# EAGLE schematic CrowBot -V1.4-20220909 (EAGLE 9.5.1)
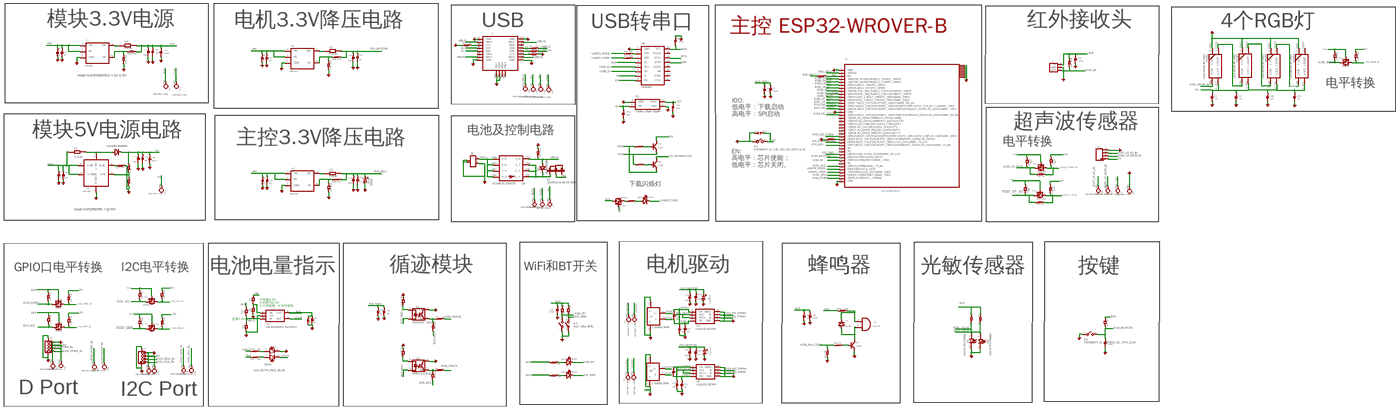
[diagram p0: schematic, sheet 1, overview]
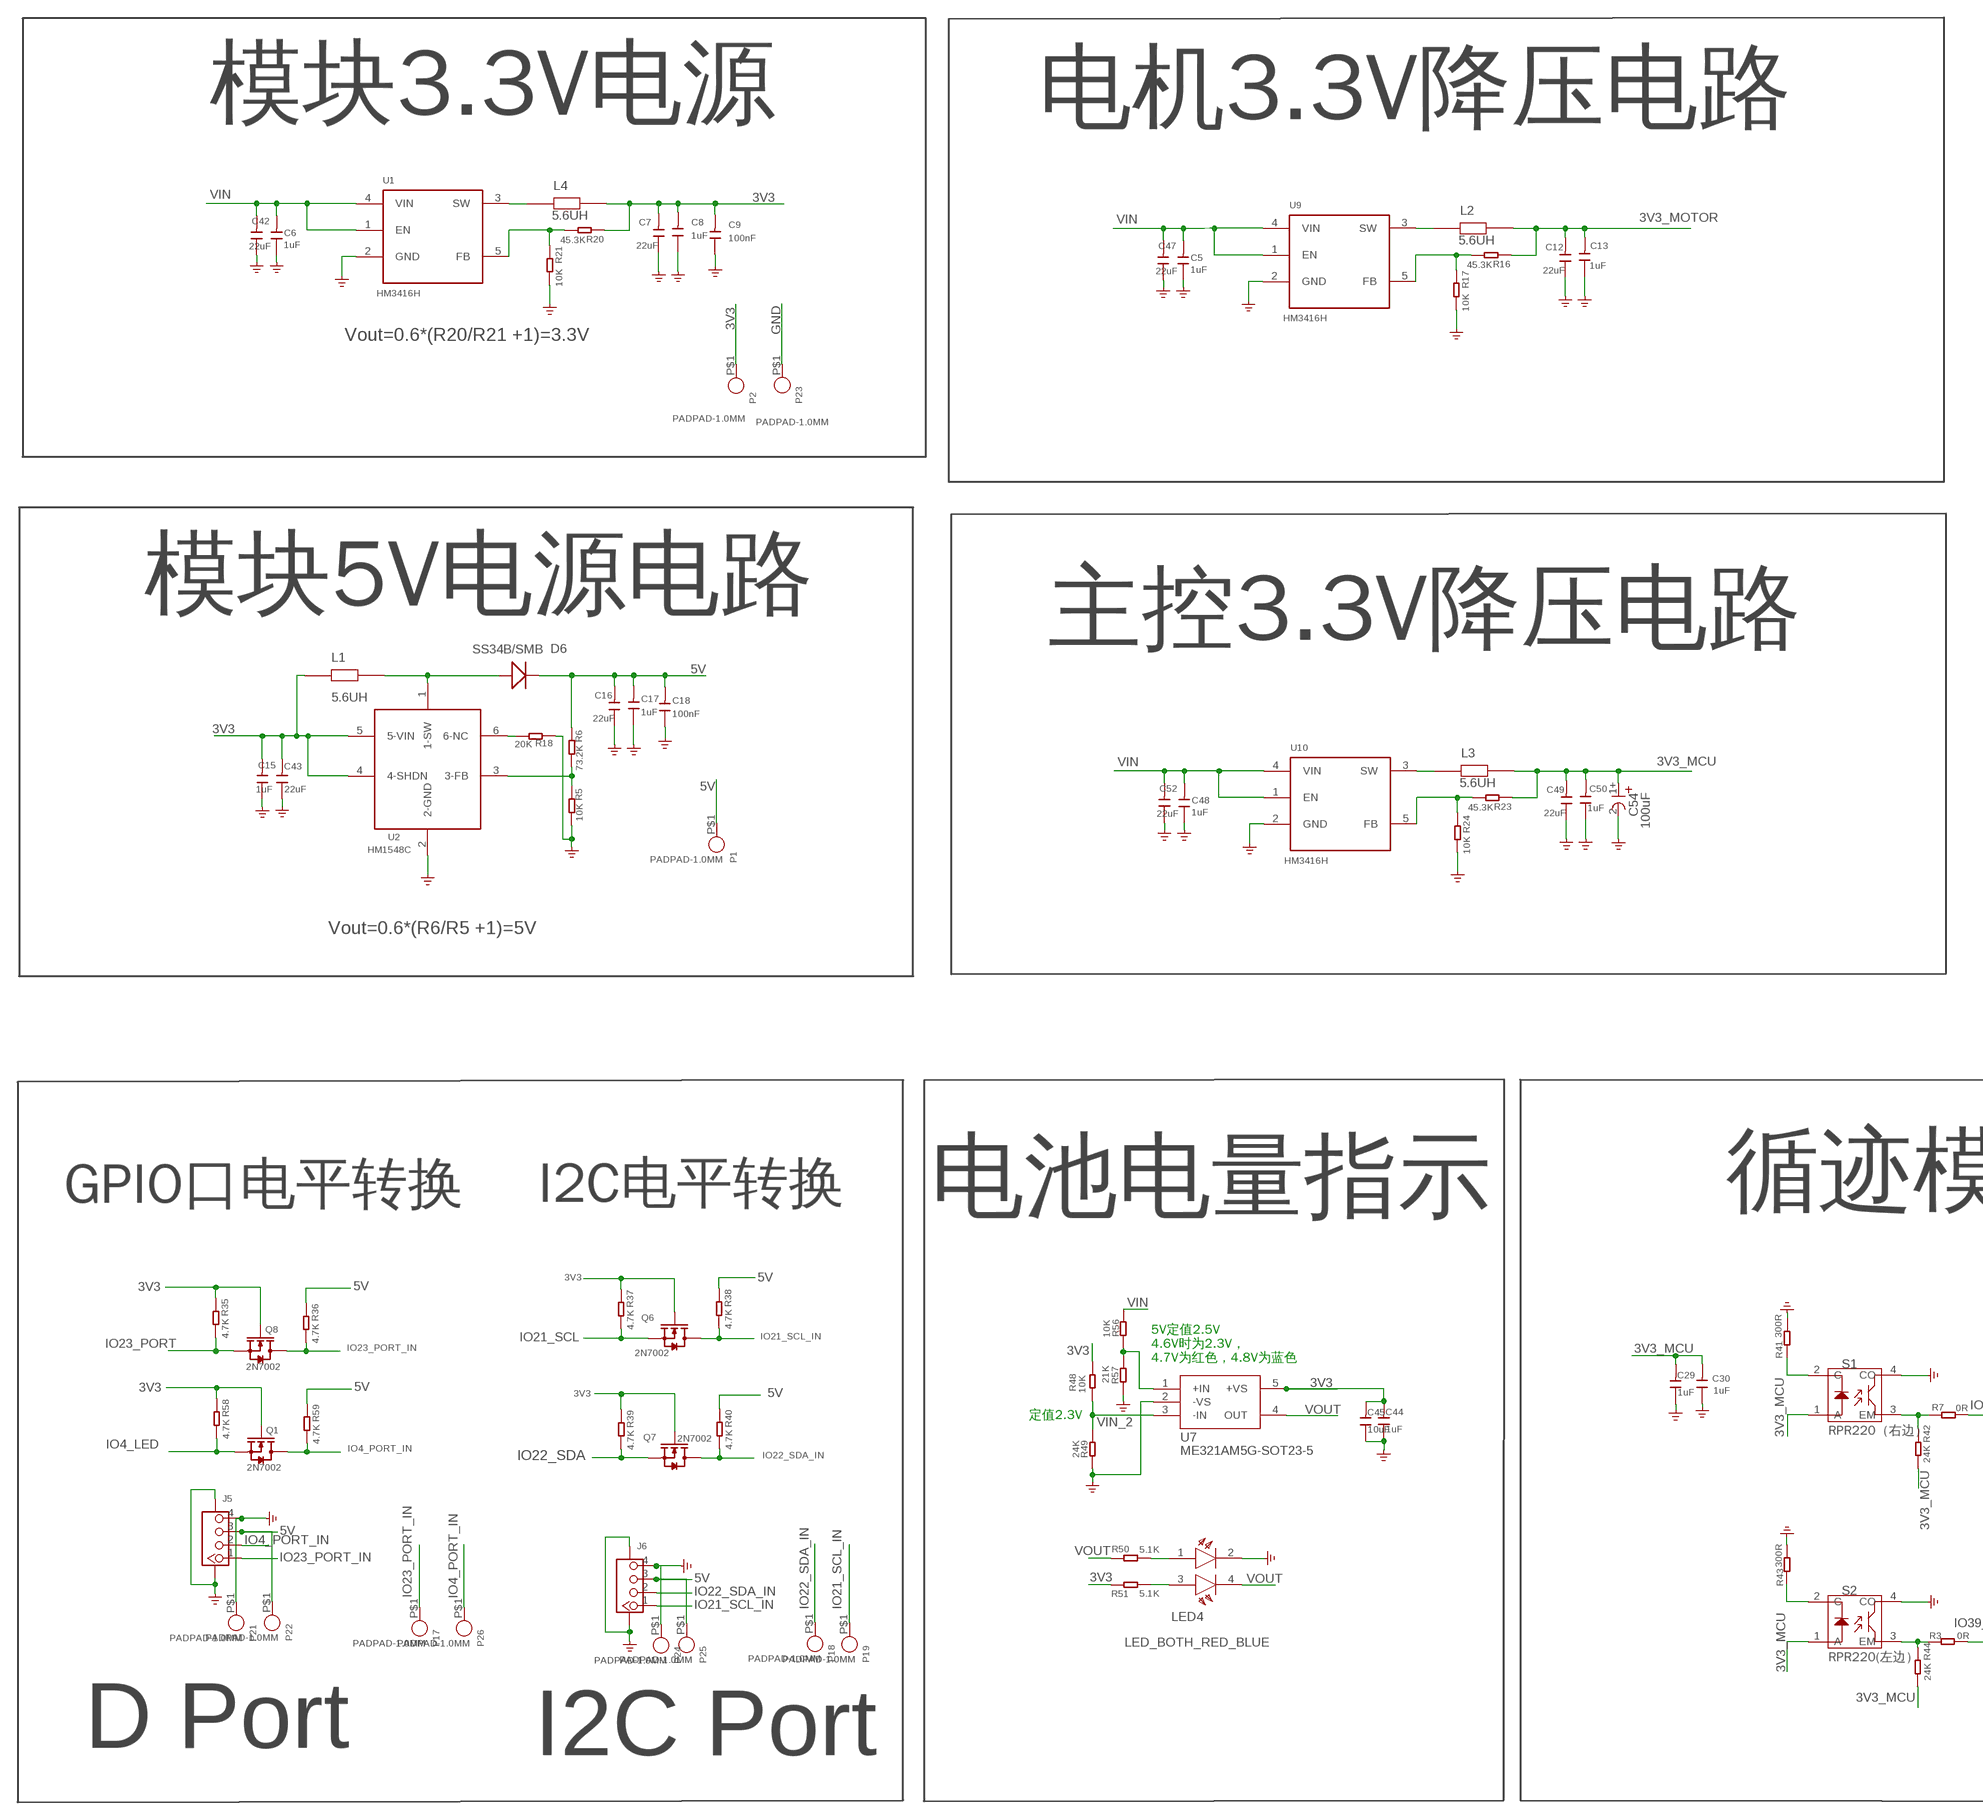
[diagram p1: schematic, sheet 1, part 1 of 4]
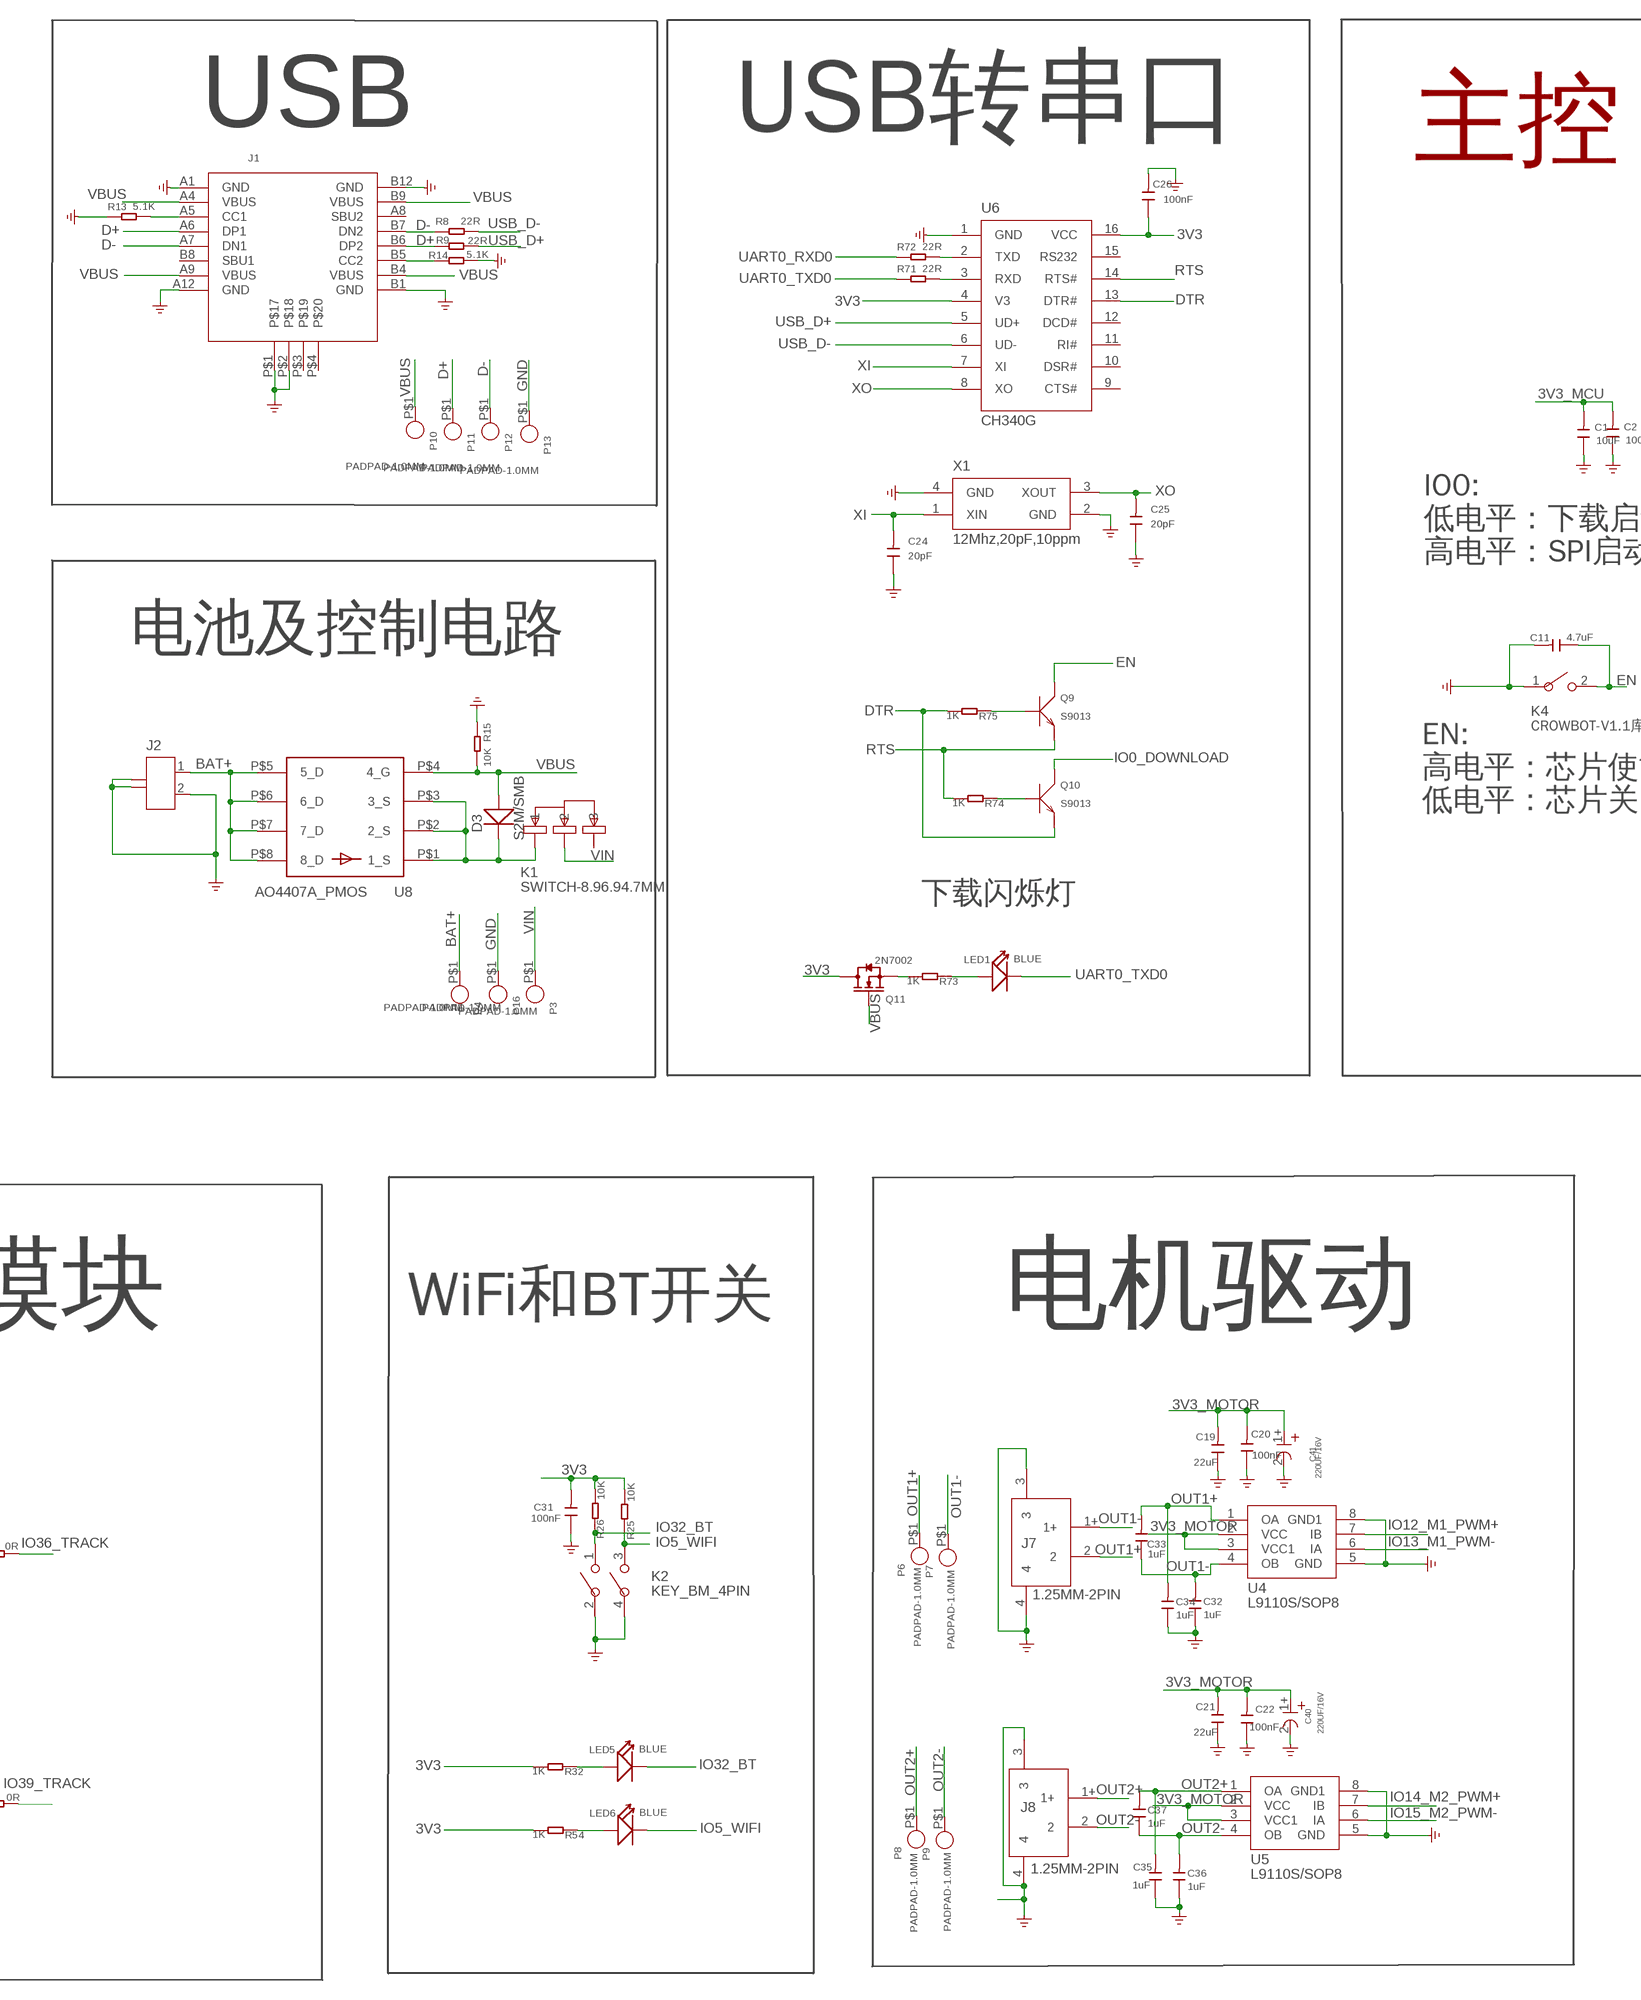
[diagram p2: schematic, sheet 1, part 2 of 4]
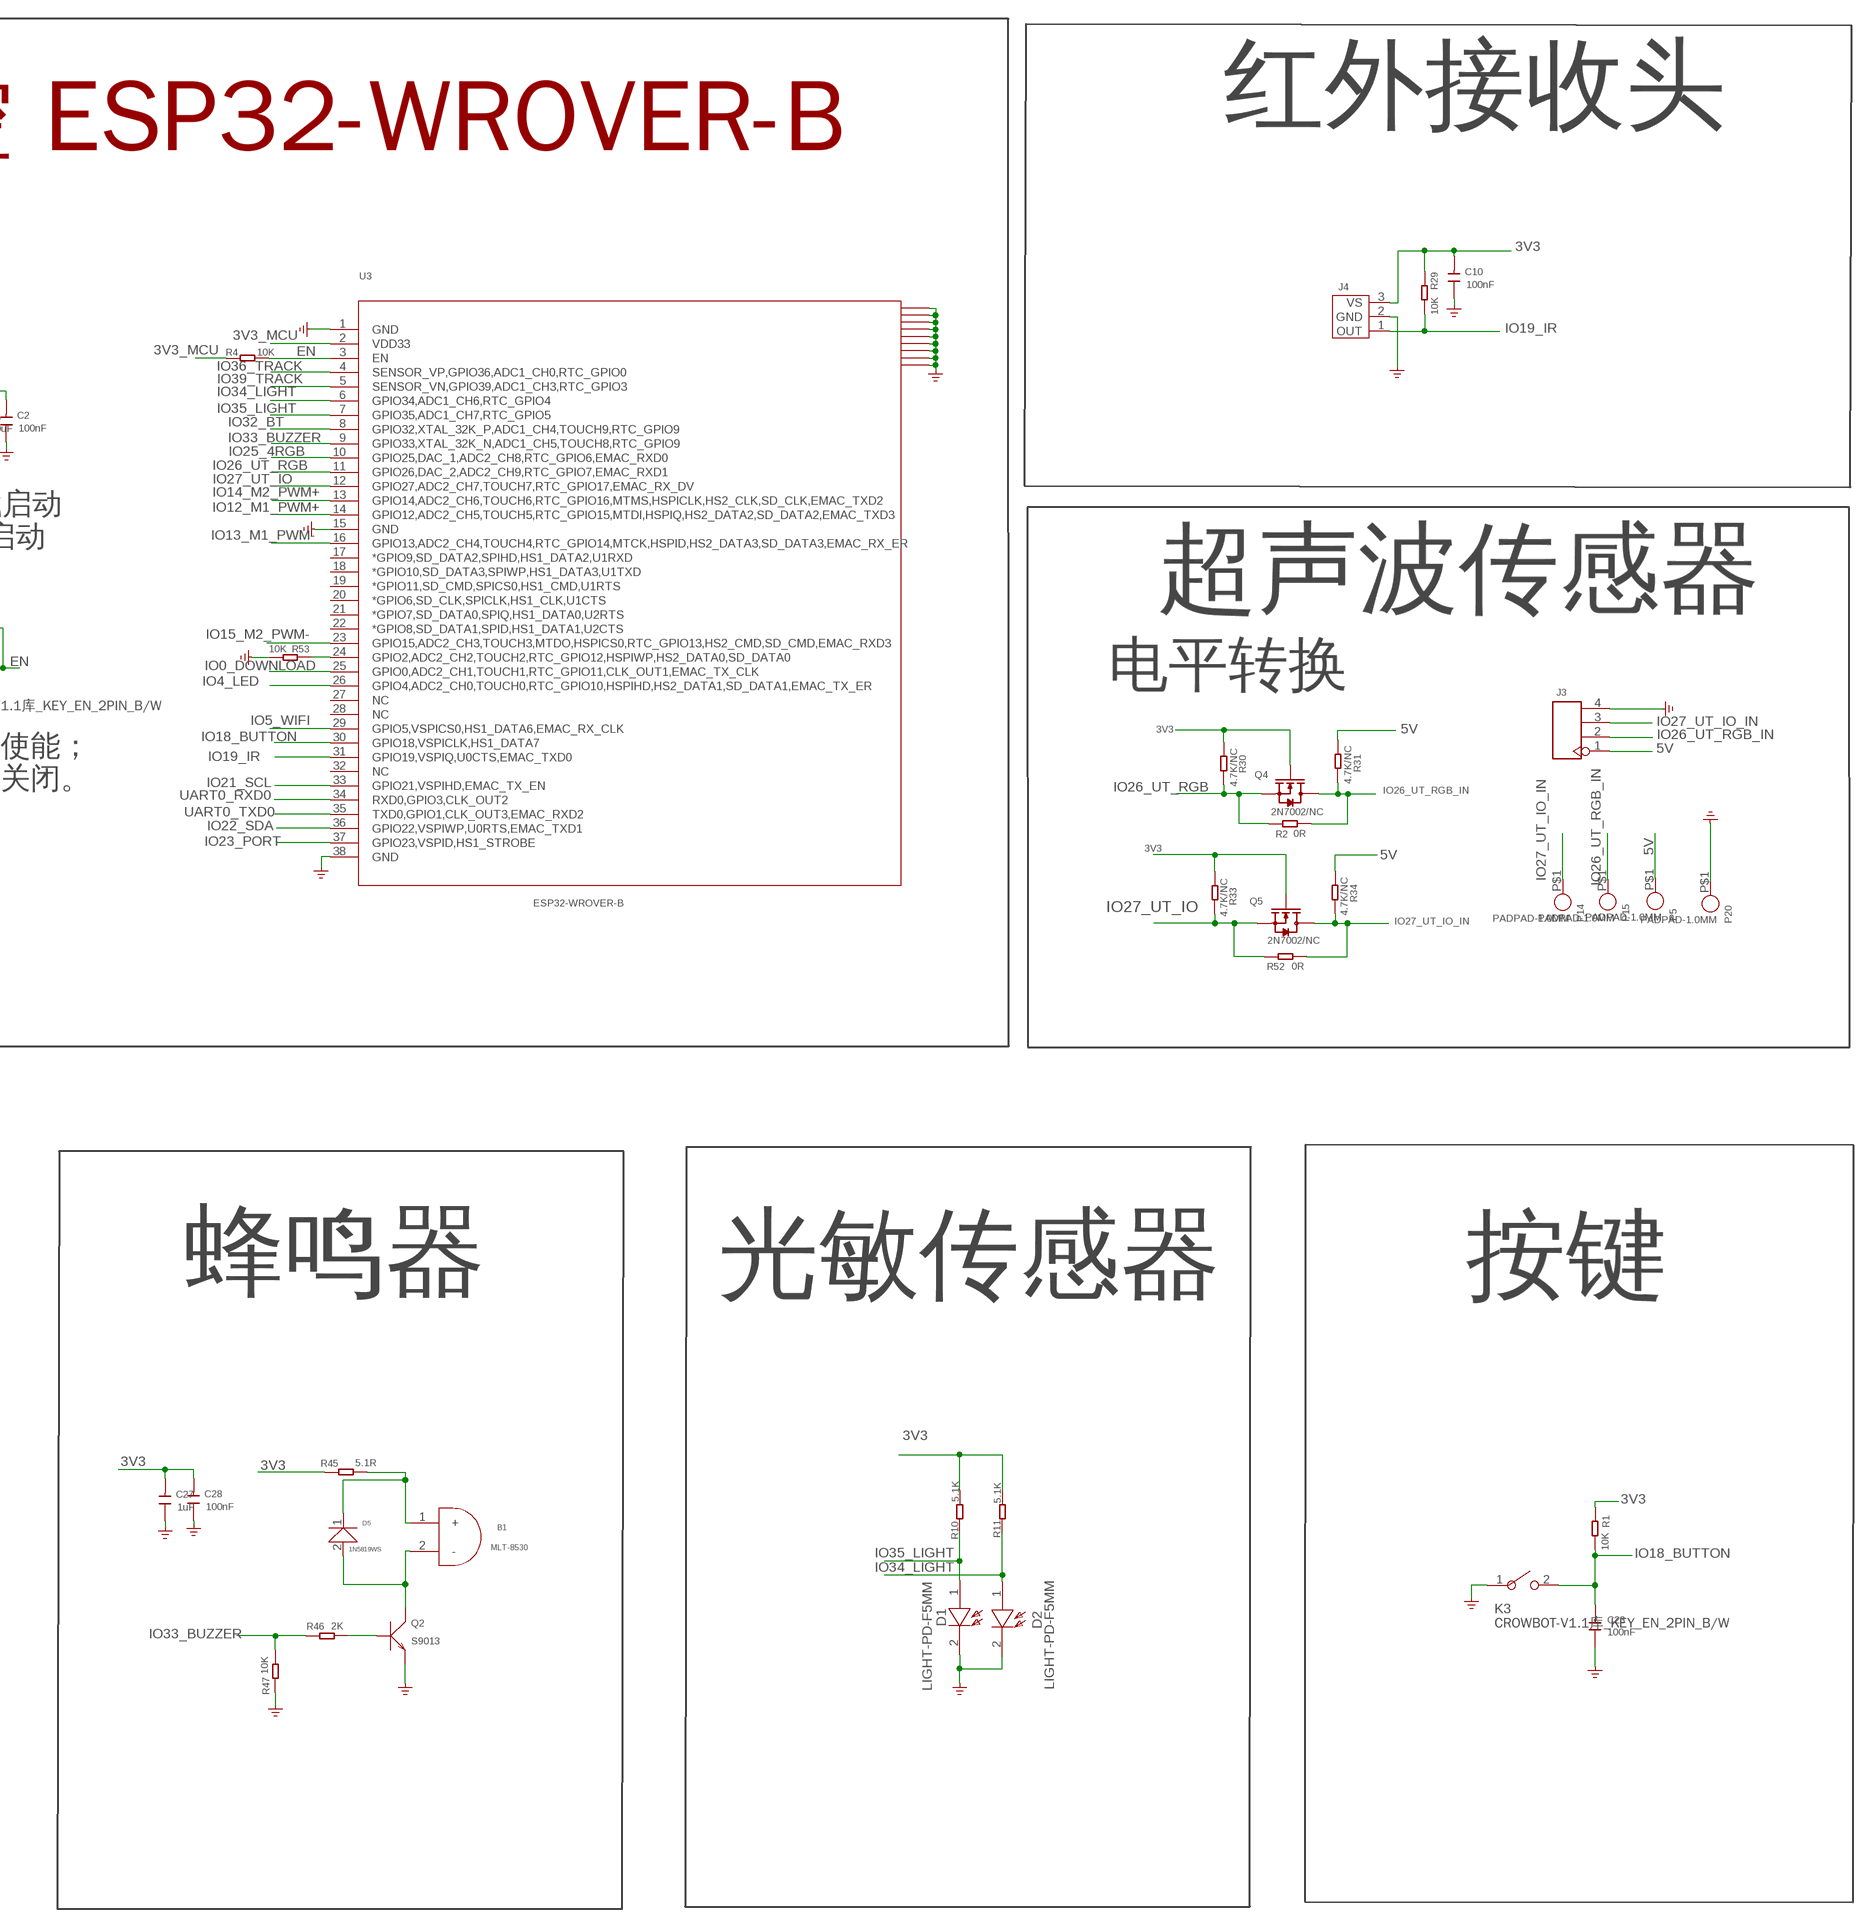
[diagram p3: schematic, sheet 1, part 3 of 4]
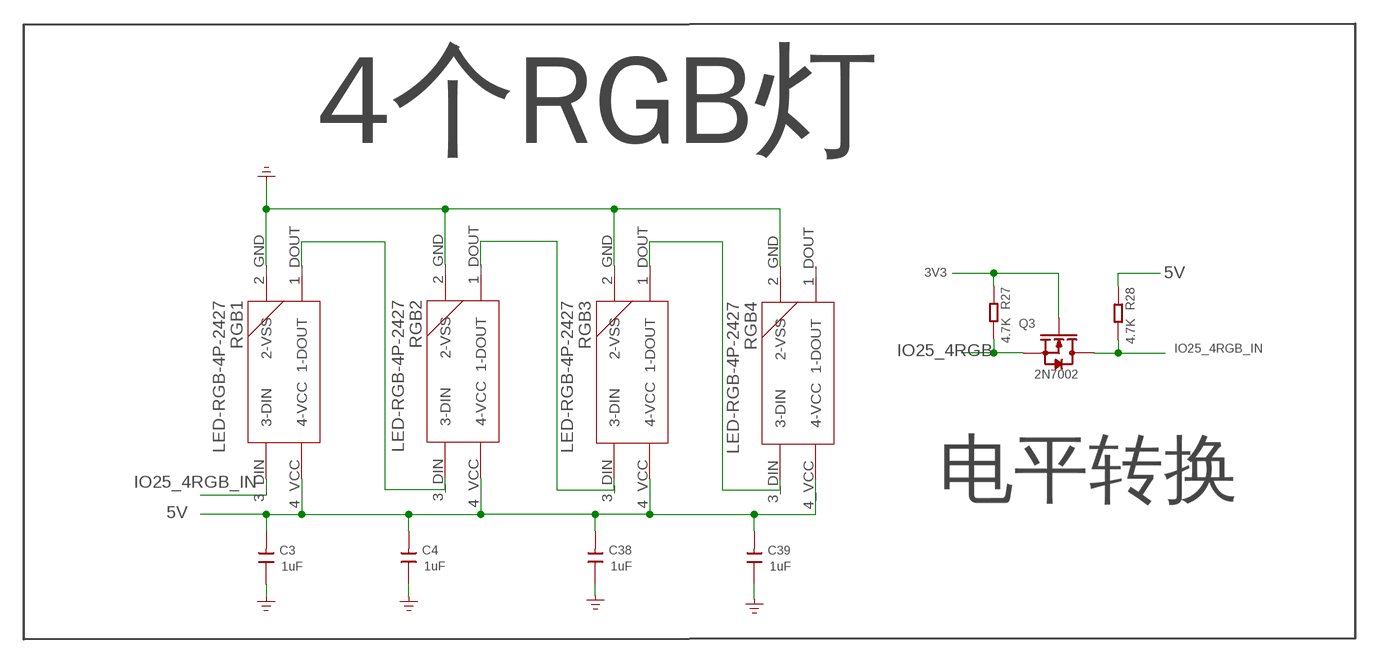
[diagram p4: schematic, sheet 1, part 4 of 4]

## Parts
B1  MLT-8530  [MLT-8530]
C1  10uF  DISCRETE_C-0603  [DISCRETE_C0603]
C2  100nF  DISCRETE_C-0603  [DISCRETE_C0603]
C3  1uF  DISCRETE_C-0603  [DISCRETE_C0603]
C4  1uF  DISCRETE_C-0603  [DISCRETE_C0603]
C5  1uF  C0603  [0603]
C6  1uF  C0603  [0603]
C7  22uF  C0805  [0805]
C8  1uF  C0603  [0603]
C9  100nF  C0603  [0603]
C10  100nF  DISCRETE_C-0603  [DISCRETE_C0603]
C11  4.7uF  C0603  [0603]
C12  22uF  C0805  [0805]
C13  1uF  C0603  [0603]
C15  1uF  C0603  [0603]
C16  22uF  C0805  [0805]
C17  1uF  C0603  [0603]
C18  100nF  C0603  [0603]
C19  22uF  C0805  [0805]
C20  100nF  DISCRETE_C-0603  [DISCRETE_C0603]
C21  22uF  C0805  [0805]
C22  100nF  DISCRETE_C-0603  [DISCRETE_C0603]
C23  100nF  DISCRETE_C-0603  [DISCRETE_C0603]
C24  20pF  C0603  [0603]
C25  20pF  C0603  [0603]
C26  100nF  C0603  [0603]
C27  1uF  DISCRETE_C-0603  [DISCRETE_C0603]
C28  100nF  DISCRETE_C-0603  [DISCRETE_C0603]
C29  1uF  DISCRETE_C-0603  [DISCRETE_C0603]
C30  1uF  DISCRETE_C-0603  [DISCRETE_C0603]
C31  100nF  DISCRETE_C-0603  [DISCRETE_C0603]
C32  1uF  C0603  [0603]
C33  1uF  C0603  [0603]
C34  1uF  C0603  [0603]
C35  1uF  C0603  [0603]
C36  1uF  C0603  [0603]
C37  1uF  C0603  [0603]
C38  1uF  DISCRETE_C-0603  [DISCRETE_C0603]
C39  1uF  DISCRETE_C-0603  [DISCRETE_C0603]
C40  220UF/16V  CAP_220UF_SMD_6.35.4MM  [CAP_220UF_SMD_6.3*5.4MM]
C41  220UF/16V  CAP_220UF_SMD_6.35.4MM  [CAP_220UF_SMD_6.3*5.4MM]
C42  22uF  C0805  [0805]
C43  22uF  C0805  [0805]
C44  1uF  DISCRETE_C-0603  [DISCRETE_C0603]
C45  10uF  DISCRETE_C-0603  [DISCRETE_C0603]
C47  22uF  C0805  [0805]
C48  1uF  C0603  [0603]
C49  22uF  C0805  [0805]
C50  1uF  C0603  [0603]
C52  22uF  C0805  [0805]
C54  100uF  CAP-100UF-SMD-6.34.5MM  [CAP-100UF-SMD-6.3*4.5MM]
D1  LIGHT-PD-F5MM  [LIGHT-PD-F5MM]
D2  LIGHT-PD-F5MM  [LIGHT-PD-F5MM]
D3  S2M/SMB  214ABDO-214AB  [214AB]
D5  1N5819WS  [SOD-323]
D6  SS34B/SMB  214ABDO-214AB  [214AB]
J1  TYPEC-3.0-16P-SMD  [TYPEC-3.0-16P-SMD]
J2  PH2.0_2P  [PH2.0_2P]
J3  HEADER-4P-80/40MIL  [4P-2.54-80/40MIL]
J4  TSOP382  [3P-2.54-4.8X5X6.95H]
J5  CONNECTOR_TWIG-4P-2.0-SMD-FEMALE-REINFORCE90D  [CONNECTOR_4P-SMD-2.0-90D]
J6  CONNECTOR_TWIG-4P-2.0-SMD-FEMALE-REINFORCE90D  [CONNECTOR_4P-SMD-2.0-90D]
J7  1.25MM-2PIN  CROWBOT-V1.0库_1.25MM-2PIN  [CROWBOT-V1.0库_1.25MM-2PIN]
J8  1.25MM-2PIN  CROWBOT-V1.0库_1.25MM-2PIN  [CROWBOT-V1.0库_1.25MM-2PIN]
K1  SWITCH-8.96.94.7MM  [SWITCH-8.9*6.9*4.7MM]
K2  KEY_BM_4PIN  [KEY_BM_4PIN]
K3  CROWBOT-V1.1库_KEY_EN_2PIN_B/W  [CROWBOT-V1.1库_KEY_EN_2PIN_B/W]
K4  CROWBOT-V1.1库_KEY_EN_2PIN_B/W  [CROWBOT-V1.1库_KEY_EN_2PIN_B/W]
L1  5.6UH  CROWPI2-MB-V1.4-20211012_CMP201209UD1R0MT  [CD54]
L2  5.6UH  CROWPI2-MB-V1.4-20211012_CMP201209UD1R0MT  [CD54]
L3  5.6UH  CROWPI2-MB-V1.4-20211012_CMP201209UD1R0MT  [CD54]
L4  5.6UH  CROWPI2-MB-V1.4-20211012_CMP201209UD1R0MT  [CD54]
LED1  BLUE  DISCRETE_LED0603  [DISCRETE_LED-0603]
LED4  LED_BOTH_RED_BLUE  [LED_BOTH_RED_BLUE_SMD_1.6*1.6*0.6MM]
LED5  BLUE  DISCRETE_LED0603  [DISCRETE_LED-0603]
LED6  BLUE  DISCRETE_LED0603  [DISCRETE_LED-0603]
P1  PADPAD-1.0MM  [PAD-1.0MM]
P2  PADPAD-1.0MM  [PAD-1.0MM]
P3  PADPAD-1.0MM  [PAD-1.0MM]
P4  PADPAD-1.0MM  [PAD-1.0MM]
P5  PADPAD-1.0MM  [PAD-1.0MM]
P6  PADPAD-1.0MM  [PAD-1.0MM]
P7  PADPAD-1.0MM  [PAD-1.0MM]
P8  PADPAD-1.0MM  [PAD-1.0MM]
P9  PADPAD-1.0MM  [PAD-1.0MM]
P10  PADPAD-1.0MM  [PAD-1.0MM]
P11  PADPAD-1.0MM  [PAD-1.0MM]
P12  PADPAD-1.0MM  [PAD-1.0MM]
P13  PADPAD-1.0MM  [PAD-1.0MM]
P14  PADPAD-1.0MM  [PAD-1.0MM]
P15  PADPAD-1.0MM  [PAD-1.0MM]
P16  PADPAD-1.0MM  [PAD-1.0MM]
P17  PADPAD-1.0MM  [PAD-1.0MM]
P18  PADPAD-1.0MM  [PAD-1.0MM]
P19  PADPAD-1.0MM  [PAD-1.0MM]
P20  PADPAD-1.0MM  [PAD-1.0MM]
P21  PADPAD-1.0MM  [PAD-1.0MM]
P22  PADPAD-1.0MM  [PAD-1.0MM]
P23  PADPAD-1.0MM  [PAD-1.0MM]
P24  PADPAD-1.0MM  [PAD-1.0MM]
P25  PADPAD-1.0MM  [PAD-1.0MM]
P26  PADPAD-1.0MM  [PAD-1.0MM]
Q1  2N7002  MOSFET-N'SOT23'  [SOT23]
Q2  S9013  TRANSISTOR-NPN-SOT23  [SOT23@1]
Q3  2N7002  MOSFET-N'SOT23'  [SOT23]
Q4  2N7002/NC  MOSFET-N'SOT23'  [SOT23]
Q5  2N7002/NC  MOSFET-N'SOT23'  [SOT23]
Q6  2N7002  MOSFET-N'SOT23'  [SOT23]
Q7  2N7002  MOSFET-N'SOT23'  [SOT23]
Q8  2N7002  MOSFET-N'SOT23'  [SOT23]
Q9  S9013  TRANSISTOR-NPN-SOT23  [SOT23@1]
Q10  S9013  TRANSISTOR-NPN-SOT23  [SOT23@1]
Q11  2N7002  MOSFET-N'SOT23'  [SOT23]
R1  10K  DISCRETE_R-0603  [DISCRETE_R0603]
R2  0R  DISCRETE_R-0603  [DISCRETE_R0603]
R3  0R  005-R0603_S  [0603_S]
R4  10K  R0603  [R0603]
R5  10K  DISCRETE_R-0603  [DISCRETE_R0603]
R6  73.2K  DISCRETE_R-0603  [DISCRETE_R0603]
R7  0R  005-R0603_S  [0603_S]
R8  22R  DISCRETE_R-0603  [DISCRETE_R0603]
R9  22R  DISCRETE_R-0603  [DISCRETE_R0603]
R10  5.1K  DISCRETE_R-0603  [DISCRETE_R0603]
R11  5.1K  DISCRETE_R-0603  [DISCRETE_R0603]
R13  5.1K  DISCRETE_R-0603  [DISCRETE_R0603]
R14  5.1K  DISCRETE_R-0603  [DISCRETE_R0603]
R15  10K  DISCRETE_R-0603  [DISCRETE_R0603]
R16  45.3K  DISCRETE_R-0603  [DISCRETE_R0603]
R17  10K  DISCRETE_R-0603  [DISCRETE_R0603]
R18  20K  DISCRETE_R-0603  [DISCRETE_R0603]
R20  45.3K  DISCRETE_R-0603  [DISCRETE_R0603]
R21  10K  DISCRETE_R-0603  [DISCRETE_R0603]
R23  45.3K  DISCRETE_R-0603  [DISCRETE_R0603]
R24  10K  DISCRETE_R-0603  [DISCRETE_R0603]
R25  10K  005-R0603_S  [0603_S]
R26  10K  005-R0603_S  [0603_S]
R27  4.7K  DISCRETE_R-0603  [DISCRETE_R0603]
R28  4.7K  DISCRETE_R-0603  [DISCRETE_R0603]
R29  10K  DISCRETE_R-0603  [DISCRETE_R0603]
R30  4.7K/NC  DISCRETE_R-0603  [DISCRETE_R0603]
R31  4.7K/NC  DISCRETE_R-0603  [DISCRETE_R0603]
R32  1K  DISCRETE_R-0603  [DISCRETE_R0603]
R33  4.7K/NC  DISCRETE_R-0603  [DISCRETE_R0603]
R34  4.7K/NC  DISCRETE_R-0603  [DISCRETE_R0603]
R35  4.7K  DISCRETE_R-0603  [DISCRETE_R0603]
R36  4.7K  DISCRETE_R-0603  [DISCRETE_R0603]
R37  4.7K  DISCRETE_R-0603  [DISCRETE_R0603]
R38  4.7K  DISCRETE_R-0603  [DISCRETE_R0603]
R39  4.7K  DISCRETE_R-0603  [DISCRETE_R0603]
R40  4.7K  DISCRETE_R-0603  [DISCRETE_R0603]
R41  300R  005-R0603_S  [0603_S]
R42  24K  005-R0603_S  [0603_S]
R43  300R  005-R0603_S  [0603_S]
R44  24K  005-R0603_S  [0603_S]
R45  5.1R  R0603  [R0603]
R46  2K  DISCRETE_R-0603  [DISCRETE_R0603]
R47  10K  DISCRETE_R-0603  [DISCRETE_R0603]
R48  10K  R0603  [R0603]
R49  24K  R0603  [R0603]
R50  5.1K  DISCRETE_R-0603  [DISCRETE_R0603]
R51  5.1K  DISCRETE_R-0603  [DISCRETE_R0603]
R52  0R  DISCRETE_R-0603  [DISCRETE_R0603]
R53  10K  DISCRETE_R-0603  [DISCRETE_R0603]
R54  1K  DISCRETE_R-0603  [DISCRETE_R0603]
R56  10K  R0603  [R0603]
R57  21K  R0603  [R0603]
R58  4.7K  DISCRETE_R-0603  [DISCRETE_R0603]
R59  4.7K  DISCRETE_R-0603  [DISCRETE_R0603]
R71  22R  DISCRETE_R-0603  [DISCRETE_R0603]
R72  22R  DISCRETE_R-0603  [DISCRETE_R0603]
R73  1K  DISCRETE_R-0603  [DISCRETE_R0603]
R74  1K  DISCRETE_R-0603  [DISCRETE_R0603]
R75  1K  DISCRETE_R-0603  [DISCRETE_R0603]
RGB1  LED-RGB-4P-2427  [LED-RGB-4P-SMD-2427]
RGB2  LED-RGB-4P-2427  [LED-RGB-4P-SMD-2427]
RGB3  LED-RGB-4P-2427  [LED-RGB-4P-SMD-2427]
RGB4  LED-RGB-4P-2427  [LED-RGB-4P-SMD-2427]
S1  RPR220（右边）  REFLECTIVE-PHOTOSENSOR-RPR-220  [4P-6.4X4.9X6.5H]
S2  RPR220(左边）  REFLECTIVE-PHOTOSENSOR-RPR-220  [4P-6.4X4.9X6.5H]
U1  HM3416H  A_XBJ_HM3420B  [A_XBJ_SOT23-5]
U2  HM1548C  HM1548/SOT23-6  [A_XBJ_SOT23-6]
U3  ESP32-WROVER-B  [ESP32-WROVER-B]
U4  L9110S/SOP8  [L9110S/SOP8]
U5  L9110S/SOP8  [L9110S/SOP8]
U6  CH340G  [SOP-16]
U7  ME321AM5G-SOT23-5  [ME321AM5G-SOT23-5]
U8  AO4407A_PMOS  T_PMOS_AO4407A_SOP8  [SOP8]
U9  HM3416H  A_XBJ_HM3420B  [A_XBJ_SOT23-5]
U10  HM3416H  A_XBJ_HM3420B  [A_XBJ_SOT23-5]
X1  12Mhz,20pF,10ppm  XTAL  [SMD3225]

## Nets
3V3: C7.2 C8.2 C9.2 C10.2 C15.2 C26.1 C27.2 C28.2 C31.2 C43.2 C44.2 C45.2 J4.3(VS) L1.1 L4.2 P2.P$1 Q1.1(G) Q3.1(G) Q4.1(G) Q5.1(G) Q6.1(G) Q7.1(G) Q8.1(G) Q11.3(D) R1.1 R10.2 R11.2 R20.1 R25.2 R26.2 R27.1 R29.1 R30.1 R32.2 R33.1 R35.1 R37.1 R39.1 R45.1 R48.1 R51.2 R54.2 R58.1 U2.4(4-SHDN) U2.5(5-VIN) U6.4(V3) U6.16(VCC) U7.5(+VS)
3V3_MCU: C1.2 C2.2 C29.2 C30.2 C49.2 C50.2 C54.1+ L3.2 R4.1 R23.1 R42.1 R44.1 S1.1(A) S2.1(A) U3.2(VDD33)
3V3_MOTOR: C12.2 C13.2 C19.2 C20.2 C21.2 C22.2 C40.1+ C41.1+ L2.2 R16.1 U4.2(VCC) U4.3(VCC1) U5.2(VCC) U5.3(VCC1)
5V: C3.2 C4.2 C16.2 C17.2 C18.2 C38.2 C39.2 D6.2(-) J3.1 J5.3 J6.3 P1.P$1 P5.P$1 P22.P$1 P25.P$1 R6.1 R28.1 R31.1 R34.1 R36.1 R38.1 R40.1 R59.1 RGB1.4_VCC(4-VCC) RGB2.4_VCC(4-VCC) RGB3.4_VCC(4-VCC) RGB4.4_VCC(4-VCC)
BAT+: J2.1 P4.P$1 U8.P$5(5_D) U8.P$6(6_D) U8.P$7(7_D) U8.P$8(8_D)
D+: J1.A6(DP1) J1.B6(DP2) P11.P$1 R9.1
D-: J1.A7(DN1) J1.B7(DN2) P12.P$1 R8.1
DTR: Q10.2(E) R75.2 U6.13(DTR#)
EN: C11.1 K4.2 Q9.3(C) R4.2 U3.3(EN)
GND: C1.1 C2.1 C3.1 C4.1 C5.1 C6.1 C7.1 C8.1 C9.1 C10.1 C11.2 C12.1 C13.1 C15.1 C16.1 C17.1 C18.1 C19.1 C20.1 C21.1 C22.1 C23.1 C24.1 C25.1 C26.2 C27.1 C28.1 C29.1 C30.1 C31.1 C32.1 C34.1 C35.1 C36.1 C38.1 C39.1 C40.2- C41.2- C42.1 C43.1 C44.1 C45.1 C47.1 C48.1 C49.1 C50.1 C52.1 C54.2- D1.2 D2.2 J1.A1(GND) J1.A12(GND) J1.B1(GND) J1.B12(GND) J1.P$1 J1.P$2 J2.2 J2.3 J2.4 J3.4 J4.2(GND) J5.4 J5.SS1 J5.SS2 J6.4 J6.SS1 J6.SS2 J7.3 J7.4 J8.3 J8.4 K2.2 K2.4 K3.1 K4.1 LED4.2 P13.P$1 P16.P$1 P20.P$1 P21.P$1 P23.P$1 P24.P$1 Q2.2(E) R5.2 R13.1 R14.2 R15.1 R17.2 R18.1 R21.2 R24.2 R41.1 R43.1 R47.1 R49.2 R53.2 R57.2 RGB1.2_GND(2-VSS) RGB2.2_GND(2-VSS) RGB3.2_GND(2-VSS) RGB4.2_GND(2-VSS) S1.4(CO) S2.4(CO) U1.2(GND) U2.2(2-GND) U3.1(GND) U3.15(GND) U3.38(GND) U3.39(GND) U3.40(GND) U3.41(GND) U3.42(GND) U3.43(GND) U3.44(GND) U3.45(GND) U3.46(GND) U3.47(GND) U4.5(GND) U4.8(GND1) U5.5(GND) U5.8(GND1) U6.1(GND) U7.2(-VS) U9.2(GND) U10.2(GND) X1.2(GND) X1.4(GND)
IO0_DOWNLOAD: Q10.3(C) U3.25(GPIO0,ADC2_CH1,TOUCH1,RTC_GPIO11,CLK_OUT1,EMAC_TX_CLK)
IO4_LED: Q1.2(S) R58.2 U3.26(GPIO4,ADC2_CH0,TOUCH0,RTC_GPIO10,HSPIHD,HS2_DATA1,SD_DATA1,EMAC_TX_ER)
IO4_PORT_IN: J5.2 P26.P$1 Q1.3(D) R59.2
IO5_WIFI: K2.3 LED6.- R25.1 U3.29(GPIO5,VSPICS0,HS1_DATA6,EMAC_RX_CLK)
IO12_M1_PWM+: U3.14(GPIO12,ADC2_CH5,TOUCH5,RTC_GPIO15,MTDI,HSPIQ,HS2_DATA2,SD_DATA2,EMAC_TXD3) U4.7(IB)
IO13_M1_PWM-: U3.16(GPIO13,ADC2_CH4,TOUCH4,RTC_GPIO14,MTCK,HSPID,HS2_DATA3,SD_DATA3,EMAC_RX_ER) U4.6(IA)
IO14_M2_PWM+: U3.13(GPIO14,ADC2_CH6,TOUCH6,RTC_GPIO16,MTMS,HSPICLK,HS2_CLK,SD_CLK,EMAC_TXD2) U5.7(IB)
IO15_M2_PWM-: U3.23(GPIO15,ADC2_CH3,TOUCH3,MTDO,HSPICS0,RTC_GPIO13,HS2_CMD,SD_CMD,EMAC_RXD3) U5.6(IA)
IO18_BUTTON: C23.2 K3.2 R1.2 U3.30(GPIO18,VSPICLK,HS1_DATA7)
IO19_IR: J4.1(OUT) R29.2 U3.31(GPIO19,VSPIQ,U0CTS,EMAC_TXD0)
IO21_SCL: Q6.2(S) R37.2 U3.33(GPIO21,VSPIHD,EMAC_TX_EN)
IO21_SCL_IN: J6.1 P19.P$1 Q6.3(D) R38.2
IO22_SDA: Q7.2(S) R39.2 U3.36(GPIO22,VSPIWP,U0RTS,EMAC_TXD1)
IO22_SDA_IN: J6.2 P18.P$1 Q7.3(D) R40.2
IO23_PORT: Q8.2(S) R35.2 U3.37(GPIO23,VSPID,HS1_STROBE)
IO23_PORT_IN: J5.1 P17.P$1 Q8.3(D) R36.2
IO25_4RGB: Q3.2(S) R27.2 U3.10(GPIO25,DAC_1,ADC2_CH8,RTC_GPIO6,EMAC_RXD0)
IO25_4RGB_IN: Q3.3(D) R28.2 RGB1.3_DIN(3-DIN)
IO26_UT_RGB: Q4.2(S) R2.1 R30.2 U3.11(GPIO26,DAC_2,ADC2_CH9,RTC_GPIO7,EMAC_RXD1)
IO26_UT_RGB_IN: J3.2 P15.P$1 Q4.3(D) R2.2 R31.2
IO27_UT_IO: Q5.2(S) R33.2 R52.1 U3.12(GPIO27,ADC2_CH7,TOUCH7,RTC_GPIO17,EMAC_RX_DV)
IO27_UT_IO_IN: J3.3 P14.P$1 Q5.3(D) R34.2 R52.2
IO32_BT: K2.1 LED5.- R26.1 U3.8(GPIO32,XTAL_32K_P,ADC1_CH4,TOUCH9,RTC_GPIO9)
IO33_BUZZER: R46.1 R47.2 U3.9(GPIO33,XTAL_32K_N,ADC1_CH5,TOUCH8,RTC_GPIO9)
IO34_LIGHT: D2.1 R11.1 U3.6(GPIO34,ADC1_CH6,RTC_GPIO4)
IO35_LIGHT: D1.1 R10.1 U3.7(GPIO35,ADC1_CH7,RTC_GPIO5)
IO36_TRACK: R7.2 U3.4(SENSOR_VP,GPIO36,ADC1_CH0,RTC_GPIO0)
IO39_TRACK: R3.2 U3.5(SENSOR_VN,GPIO39,ADC1_CH3,RTC_GPIO3)
N$1: R23.2 R24.1 U10.5(FB)
N$2: R16.2 R17.1 U9.5(FB)
N$4: L2.1 U9.3(SW)
N$5: R56.2 R57.1 U7.1(+IN)
N$6: B1.2(-) D5.2(+) Q2.3(C)
N$7: R5.1 R6.2 U2.3(3-FB)
N$8: LED5.+ R32.1
N$9: R18.2 U2.6(6-NC)
N$10: R53.1 U3.24(GPIO2,ADC2_CH2,TOUCH2,RTC_GPIO12,HSPIWP,HS2_DATA0,SD_DATA0)
N$11: J1.A5(CC1) R13.2
N$12: R41.2 S1.2(C)
N$13: L4.1 U1.3(SW)
N$14: B1.1(+) D5.1(-) R45.2
N$15: R7.1 R42.2 S1.3(EM)
N$16: D6.1(+) L1.2 U2.1(1-SW)
N$17: RGB1.1_DOUT(1-DOUT) RGB2.3_DIN(3-DIN)
N$18: Q11.2(S) R73.2
N$19: R3.1 R44.2 S2.3(EM)
N$20: R20.2 R21.1 U1.5(FB)
N$21: J1.B5(CC2) R14.1
N$22: R43.2 S2.2(C)
N$23: L3.1 U10.3(SW)
N$24: LED6.+ R54.1
N$25: LED4.1 R50.2
N$27: RGB2.1_DOUT(1-DOUT) RGB3.3_DIN(3-DIN)
N$28: LED4.3 R51.1
N$30: RGB3.1_DOUT(1-DOUT) RGB4.3_DIN(3-DIN)
N$31: D3.2(-) K1.1 U8.P$1(1_S) U8.P$2(2_S) U8.P$3(3_S)
N$32: Q9.1(B) R75.1
N$34: Q2.1(B) R46.2
N$38: Q10.1(B) R74.1
N$39: LED1.+ R73.1
N$40: R72.2 U6.2(TXD)
N$42: R71.2 U6.3(RXD)
OUT1+: C33.2 C34.2 J7.2 P6.P$1 U4.1(OA)
OUT1-: C32.2 C33.1 J7.1+ P7.P$1 U4.4(OB)
OUT2+: C35.2 C37.2 J8.1+ P8.P$1 U5.1(OA)
OUT2-: C36.2 C37.1 J8.2 P9.P$1 U5.4(OB)
RTS: Q9.2(E) R74.2 U6.14(RTS#)
UART0_RXD0: R72.1 U3.34(RXD0,GPIO3,CLK_OUT2)
UART0_TXD0: LED1.- R71.1 U3.35(TXD0,GPIO1,CLK_OUT3,EMAC_RXD2)
USB_D+: R9.2 U6.5(UD+)
USB_D-: R8.2 U6.6(UD-)
VBUS: D3.1(+) J1.A4(VBUS) J1.A9(VBUS) J1.B4(VBUS) J1.B9(VBUS) P10.P$1 Q11.1(G) R15.2 U8.P$4(4_G)
VIN: C5.2 C6.2 C42.2 C47.2 C48.2 C52.2 K1.2 P3.P$1 R56.1 U1.1(EN) U1.4(VIN) U9.1(EN) U9.4(VIN) U10.1(EN) U10.4(VIN)
VIN_2: R48.2 R49.1 U7.3(-IN)
VOUT: LED4.4 R50.1 U7.4(OUT)
XI: C24.2 U6.7(XI) X1.1(XIN)
XO: C25.2 U6.8(XO) X1.3(XOUT)
Unconnected: J1.A8(SBU2) J1.B8(SBU1) J1.P$3 J1.P$4 K1.3 RGB4.1_DOUT(1-DOUT) U3.17(*GPIO9,SD_DATA2,SPIHD,HS1_DATA2,U1RXD) U3.18(*GPIO10,SD_DATA3,SPIWP,HS1_DATA3,U1TXD) U3.19(*GPIO11,SD_CMD,SPICS0,HS1_CMD,U1RTS) U3.20(*GPIO6,SD_CLK,SPICLK,HS1_CLK,U1CTS) U3.21(*GPIO7,SD_DATA0,SPIQ,HS1_DATA0,U2RTS) U3.22(*GPIO8,SD_DATA1,SPID,HS1_DATA1,U2CTS) U3.27(NC) U3.28(NC) U3.32(NC) U6.9(CTS#) U6.10(DSR#) U6.11(RI#) U6.12(DCD#) U6.15(RS232)

## Notes on the sheet
- 模块3.3V电源 | 电机3.3V降压电路 | USB | USB转串口 | 红外接收头 | 4个RGB灯
- 主控 ESP32-WROVER-B
- Vout=0.6*(R20/R21 +1)=3.3V
- 电平转换
- IO0:
  低电平：下载启动
  高电平：SPI启动
- 超声波传感器
- 模块5V电源电路 | 电池及控制电路
- 主控3.3V降压电路 | 电平转换
- EN:
  高电平：芯片使能；
  低电平：芯片关闭。
- 下载闪烁灯
- Vout=0.6*(R6/R5 +1)=5V
- GPIO口电平转换 | I2C电平转换 | 电池电量指示 | 循迹模块 | WiFi和BT开关 | 电机驱动 | 蜂鸣器 | 光敏传感器 | 按键
- 5V定值2.5V
  4.6V时为2.3V，
  4.7V为红色，4.8V为蓝色
- 定值2.3V
- D Port | I2C Port

## Library data of the parts
B1 = A_xbj:MLT-8530
C1-C4 C10 C20 C22 C23 C27-C31 C38 C39 C44 C45 = A_xbj:DISCRETE_C*: Ceramic Capacitors
C5 C6 C8 C9 C11 C13 C15 C17 C18 C24-C26 C32-C37 C48 C50 = A_xbj:C0603
C7 C12 C16 C19 C21 C42 C43 C47 C49 C52 = A_xbj:C0805
C40 C41 = CrowBot -V1.2-20220707:CAP_220UF_SMD_6.3*5.4MM
C54 = CrowBot -V1.2-20220707:CAP-100UF-SMD-6.3*4.5MM
D1 D2 = CrowBot -V1.2-20220707:LIGHT-PD-F5MM
D3 D6 = DO-214AB:214AB: 214AB
D5 = A_xbj:1N5819WS
J1 = A_xbj:TYPEC-3.0-16P-SMD
J2 = A_xbj:PH2.0_2P
J3 = Connector:HEADER-4P
J4 = IC:TSOP382: IR Receiver Modules for Remote Control Systems
J5 J6 = A_xbj:CONNECTOR_TWIG-4P-2.0-SMD-FEMALE-REINFORCE
J7 J8 = CrowBot_-V1.2-20220713:CROWBOT-V1.0库_1.25MM-2PIN
K1 = CrowBot -V1.2-20220707:SWITCH-8.9*6.9*4.7MM
K2 = Crowbot-V1.1库:KEY_BM_4PIN
K3 K4 = CrowBot -V1.4-20220830:CROWBOT-V1.1库_KEY_EN_2PIN_B/W
L1-L4 = CD54:CROWPI2-MB-V1.4-20211012_CMP201209UD1R0MT
LED1 LED5 LED6 = A_xbj:DISCRETE_LED*
LED4 = CrowBot_-V1.1-20220608:LED_BOTH_RED_BLUE
P1-P26 = crowpi_pow:PAD*
Q1 Q3-Q8 Q11 = discrete:MOSFET-N: IRLL014: http://www.vishay.com/docs/91319/sihll014.pdf
Q2 Q9 Q10 = discrete:TRANSISTOR-NPN*: NPN audion
R1 R2 R5 R6 R8-R11 R13-R18 R20 R21 R23 R24 R27-R40 R46 R47 R50-R54 R58 R59 R71-R75 = Crowtail-_LED-V2.0-20190615-01:DISCRETE_R*
R3 R7 R25 R26 R41-R44 = Discrete:005-R*
R4 R45 = A_xbj:R0603
R48 R49 R56 R57 = cooper:R0603
RGB1-RGB4 = CrowBot_-V1.0-20220525库:LED-RGB-4P-2427
S1 S2 = Discrete:REFLECTIVE-PHOTOSENSOR-RPR-220: http://wenku.baidu.com/view/18864e7d27284b73f24250aa.html
U1 U9 U10 = CrowBot_-V1.0-20220525:A_XBJ_HM3420B
U2 = CrowBOT-V1.0-20220530库:HM1548/SOT23-6
U3 = A_xbj:ESP32-WROVER-B
U4 U5 = CrowBot_-V1.0-20220525:L9110S/SOP8
U6 = A_xbj:CH340G
U7 = CrowBot_-V1.2-20220713:ME321AM5G-SOT23-5
U8 = cooper:T_PMOS_AO4407A_SOP8
X1 = A_xbj:XTAL

## Net classes
0 default: width 0.203 mm, drill 0.178 mm, clearance 0.178 mm